# Altium schematic sheet B38_15v to 5v_MC34063.SchDoc
size A
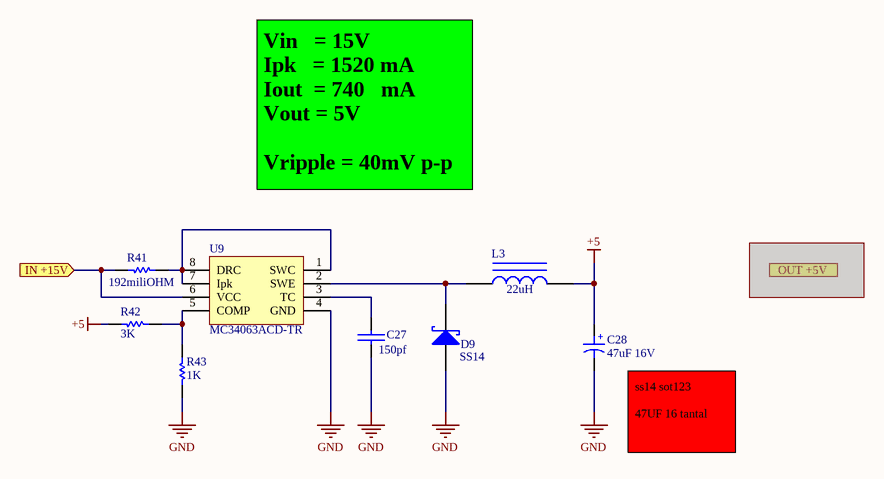
[diagram p0: B38_15v to 5v_MC34063.SchDoc]

## Parts
C27  150pf  [CAP0603]
C28  47uF 16V  [Capacitor Tantalum]
D9  SS14  [M7(1n4007 SMD)DO214]
L3  22uH  [IND-5.8MM]
R41  192miliOHM  [RES0603]
R42  3K  [RES0603]
R43  1K  [RES0603]
U9  MC34063ACD-TR  [SO-8]

## Ports
IN +15V (in), OUT +5V (out)

## Nets
+5: C28.1 L3.2 R42.2
GND: C27.2(-) C28.2 D9.1 R43.2 U9.4(GND)
IN +15V: R41.2 U9.6(VCC) ; port IN +15V
NetC27_1: C27.1(+) U9.3(TC)
NetD9_2: D9.2 L3.1 U9.2(SWE)
NetR41_1: R41.1 U9.1(SWC) U9.7(Ipk) U9.8(DRC)
NetR42_1: R42.1 R43.1 U9.5(COMP)

## Notes on the sheet
- Vin   = 15V
  Ipk   = 1520 mA
  Iout  = 740   mA
  Vout = 5V
  Vripple = 40mV p-p
- (near C28) ss14 sot123
  47UF 16 tantal
- (in symbol Cap_elec) +

## Library data of the parts
C27 = CAP: 37pF ±10% 50V X7R 0603 Multilayer Ceramic Capacitors MLCC - SMD/SMT
C28 = Cap_elec: tantalum capacitor package size A (1206); Designer: Abbas Basereh; VALUE: 1uF; Data: 16-12-2016; Part. No: *
D9 = schottky: 40V 500mV@1A 1A SMA(DO-214AC or SMA) Schottky Barrier Diodes
L3 = Inductor Iron: CD54 220uH = CD54 is L×W×H: 6.1×5.5×4.85mm  Maximum DC Current = 2.3A; Parameter 1: *
R41 = Res: 100mW Thick Film Resistors 50V ±1% ±100ppm/℃ 150mΩ -55℃~+125℃ 0603 Chip Resistor - Surface Mount ROHS; Value: 1K; Published: 8-Jun-2000; LatestRevisionDate: 17-Jul-2002; LatestRevisionNote: Re-released for DXP Platform.; PackageReference: AXIAL-0.3; Publisher: Altium Limited; PackageDescription: Axial Device, Thru-Hole; 2 Leads; 0.3 in Pin Spacing
R42 = Res: 100mW Thick Film Resistors 50V ±1% ±100ppm/℃ 28kΩ -55℃~+125℃ 0603 Chip Resistor - Surface Mount ROHS
R43 = Res: 100mW Thick Film Resistors 50V ±1% ±100ppm/℃ 12kΩ -55℃~+125℃ 0603 Chip Resistor - Surface Mount ROHS; part number: AECR0603F12K0K9
U9 = MC34063: manufacturer: ST; part number: MC34063ACD-TR